# EAGLE design 36s_Cell_Fixtures_3by3 (EAGLE 5.12)
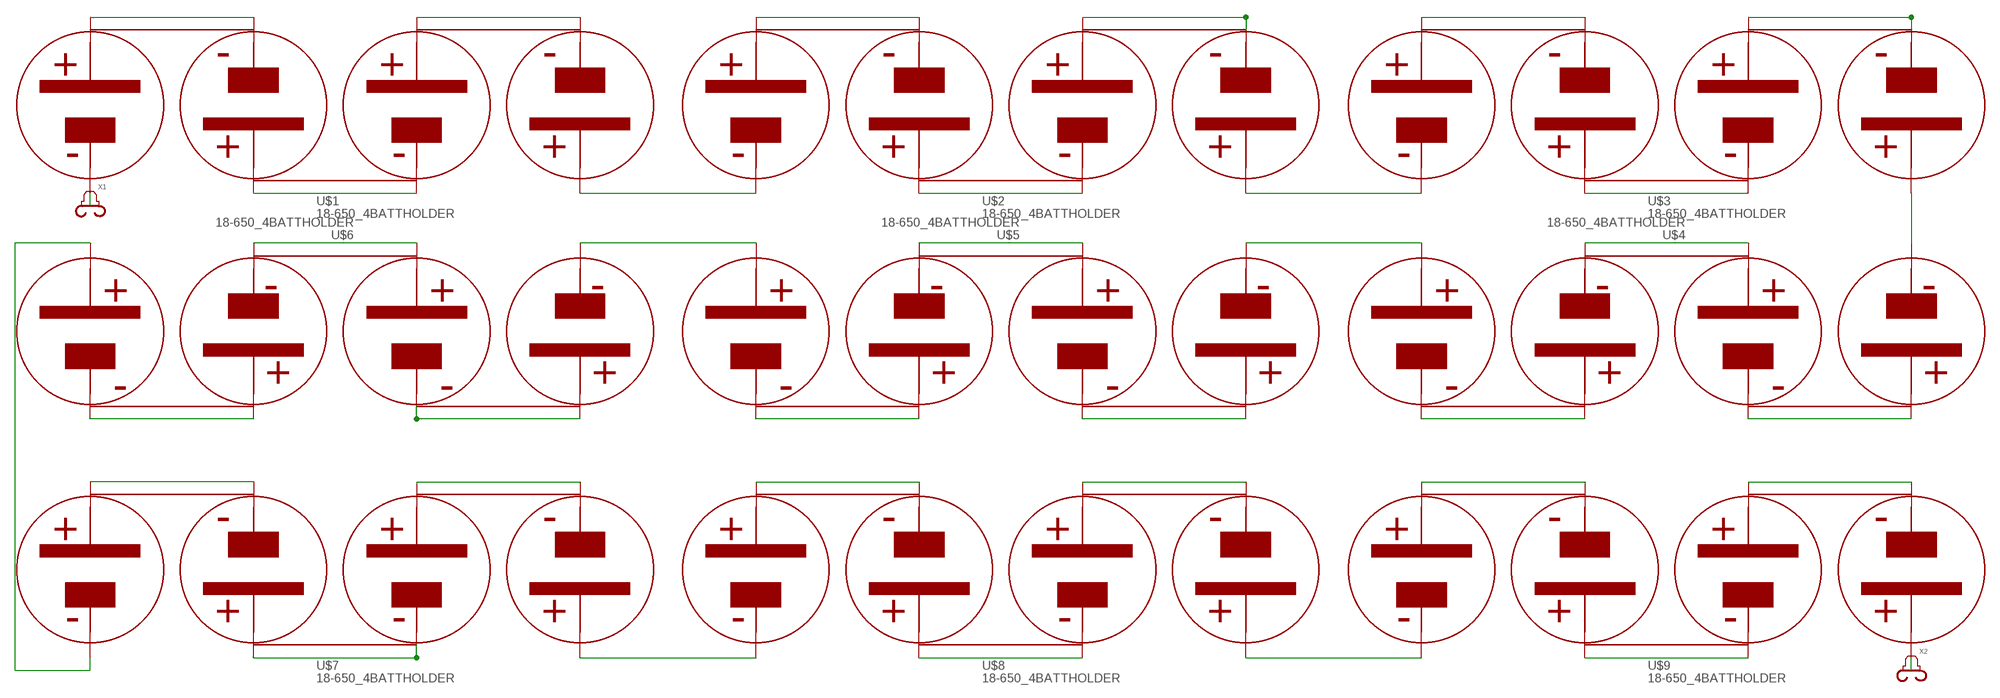
[diagram p0: schematic, sheet 1]

## Parts
U$1  18-650_4BATTHOLDER  [18650-4BATT]
U$2  18-650_4BATTHOLDER  [18650-4BATT]
U$3  18-650_4BATTHOLDER  [18650-4BATT]
U$4  18-650_4BATTHOLDER  [18650-4BATT]
U$5  18-650_4BATTHOLDER  [18650-4BATT]
U$6  18-650_4BATTHOLDER  [18650-4BATT]
U$7  18-650_4BATTHOLDER  [18650-4BATT]
U$8  18-650_4BATTHOLDER  [18650-4BATT]
U$9  18-650_4BATTHOLDER  [18650-4BATT]
X1  FASTON_FEMALE_BLADE_CONN-HORIZ-PCB  [FASTON_1217107-1]
X2  FASTON_FEMALE_BLADE_CONN-HORIZ-PCB  [FASTON_1217107-1]

## Nets
N$1: U$1.BATT+1 U$1.BATT-2
N$2: U$1.BATT+2 U$1.BATT-3
N$3: U$1.BATT+3 U$1.BATT-4
N$4: U$1.BATT+4 U$2.BATT-1
N$5: U$2.BATT+1 U$2.BATT-2
N$6: U$2.BATT+2 U$2.BATT-3
N$7: U$2.BATT+3 U$2.BATT-4
N$8: U$2.BATT+4 U$3.BATT-1
N$9: U$3.BATT+1 U$3.BATT-2
N$10: U$3.BATT+2 U$3.BATT-3
N$11: U$3.BATT+3 U$3.BATT-4
N$12: U$3.BATT+4 U$4.BATT-1
N$13: U$4.BATT+1 U$4.BATT-2
N$14: U$4.BATT+2 U$4.BATT-3
N$15: U$4.BATT+3 U$4.BATT-4
N$16: U$4.BATT+4 U$5.BATT-1
N$17: U$5.BATT+1 U$5.BATT-2
N$18: U$5.BATT+2 U$5.BATT-3
N$19: U$5.BATT+3 U$5.BATT-4
N$20: U$5.BATT+4 U$6.BATT-1
N$21: U$6.BATT+1 U$6.BATT-2
N$22: U$6.BATT+2 U$6.BATT-3
N$23: U$6.BATT+3 U$6.BATT-4
N$24: U$6.BATT+4 U$7.BATT-1
N$25: U$7.BATT+1 U$7.BATT-2
N$26: U$7.BATT+2 U$7.BATT-3
N$27: U$7.BATT+3 U$7.BATT-4
N$28: U$7.BATT+4 U$8.BATT-1
N$29: U$8.BATT+1 U$8.BATT-2
N$30: U$8.BATT+2 U$8.BATT-3
N$31: U$8.BATT+3 U$8.BATT-4
N$32: U$8.BATT+4 U$9.BATT-1
N$33: U$9.BATT+1 U$9.BATT-2
N$34: U$9.BATT+2 U$9.BATT-3
N$35: U$9.BATT+3 U$9.BATT-4
N$36: U$1.BATT-1 X1.1
N$37: U$9.BATT+4 X2.1

## Library data of the parts
U$1-U$9 = MPD:18-650_4BATTHOLDER: Datasheet: http://www.memoryprotectiondevices.com/datasheets/BK-18650-PC8-datasheet.pdf Used in 18-650 cell fixtures 12/3/14; PARTNO: BK-18650-PC8
X1 X2 = TE-Aaron:FASTON_FEMALE_BLADE_CONN: TE Faston - female PCB-mount blade terminal; PARTNO: 1217107-1

## Board
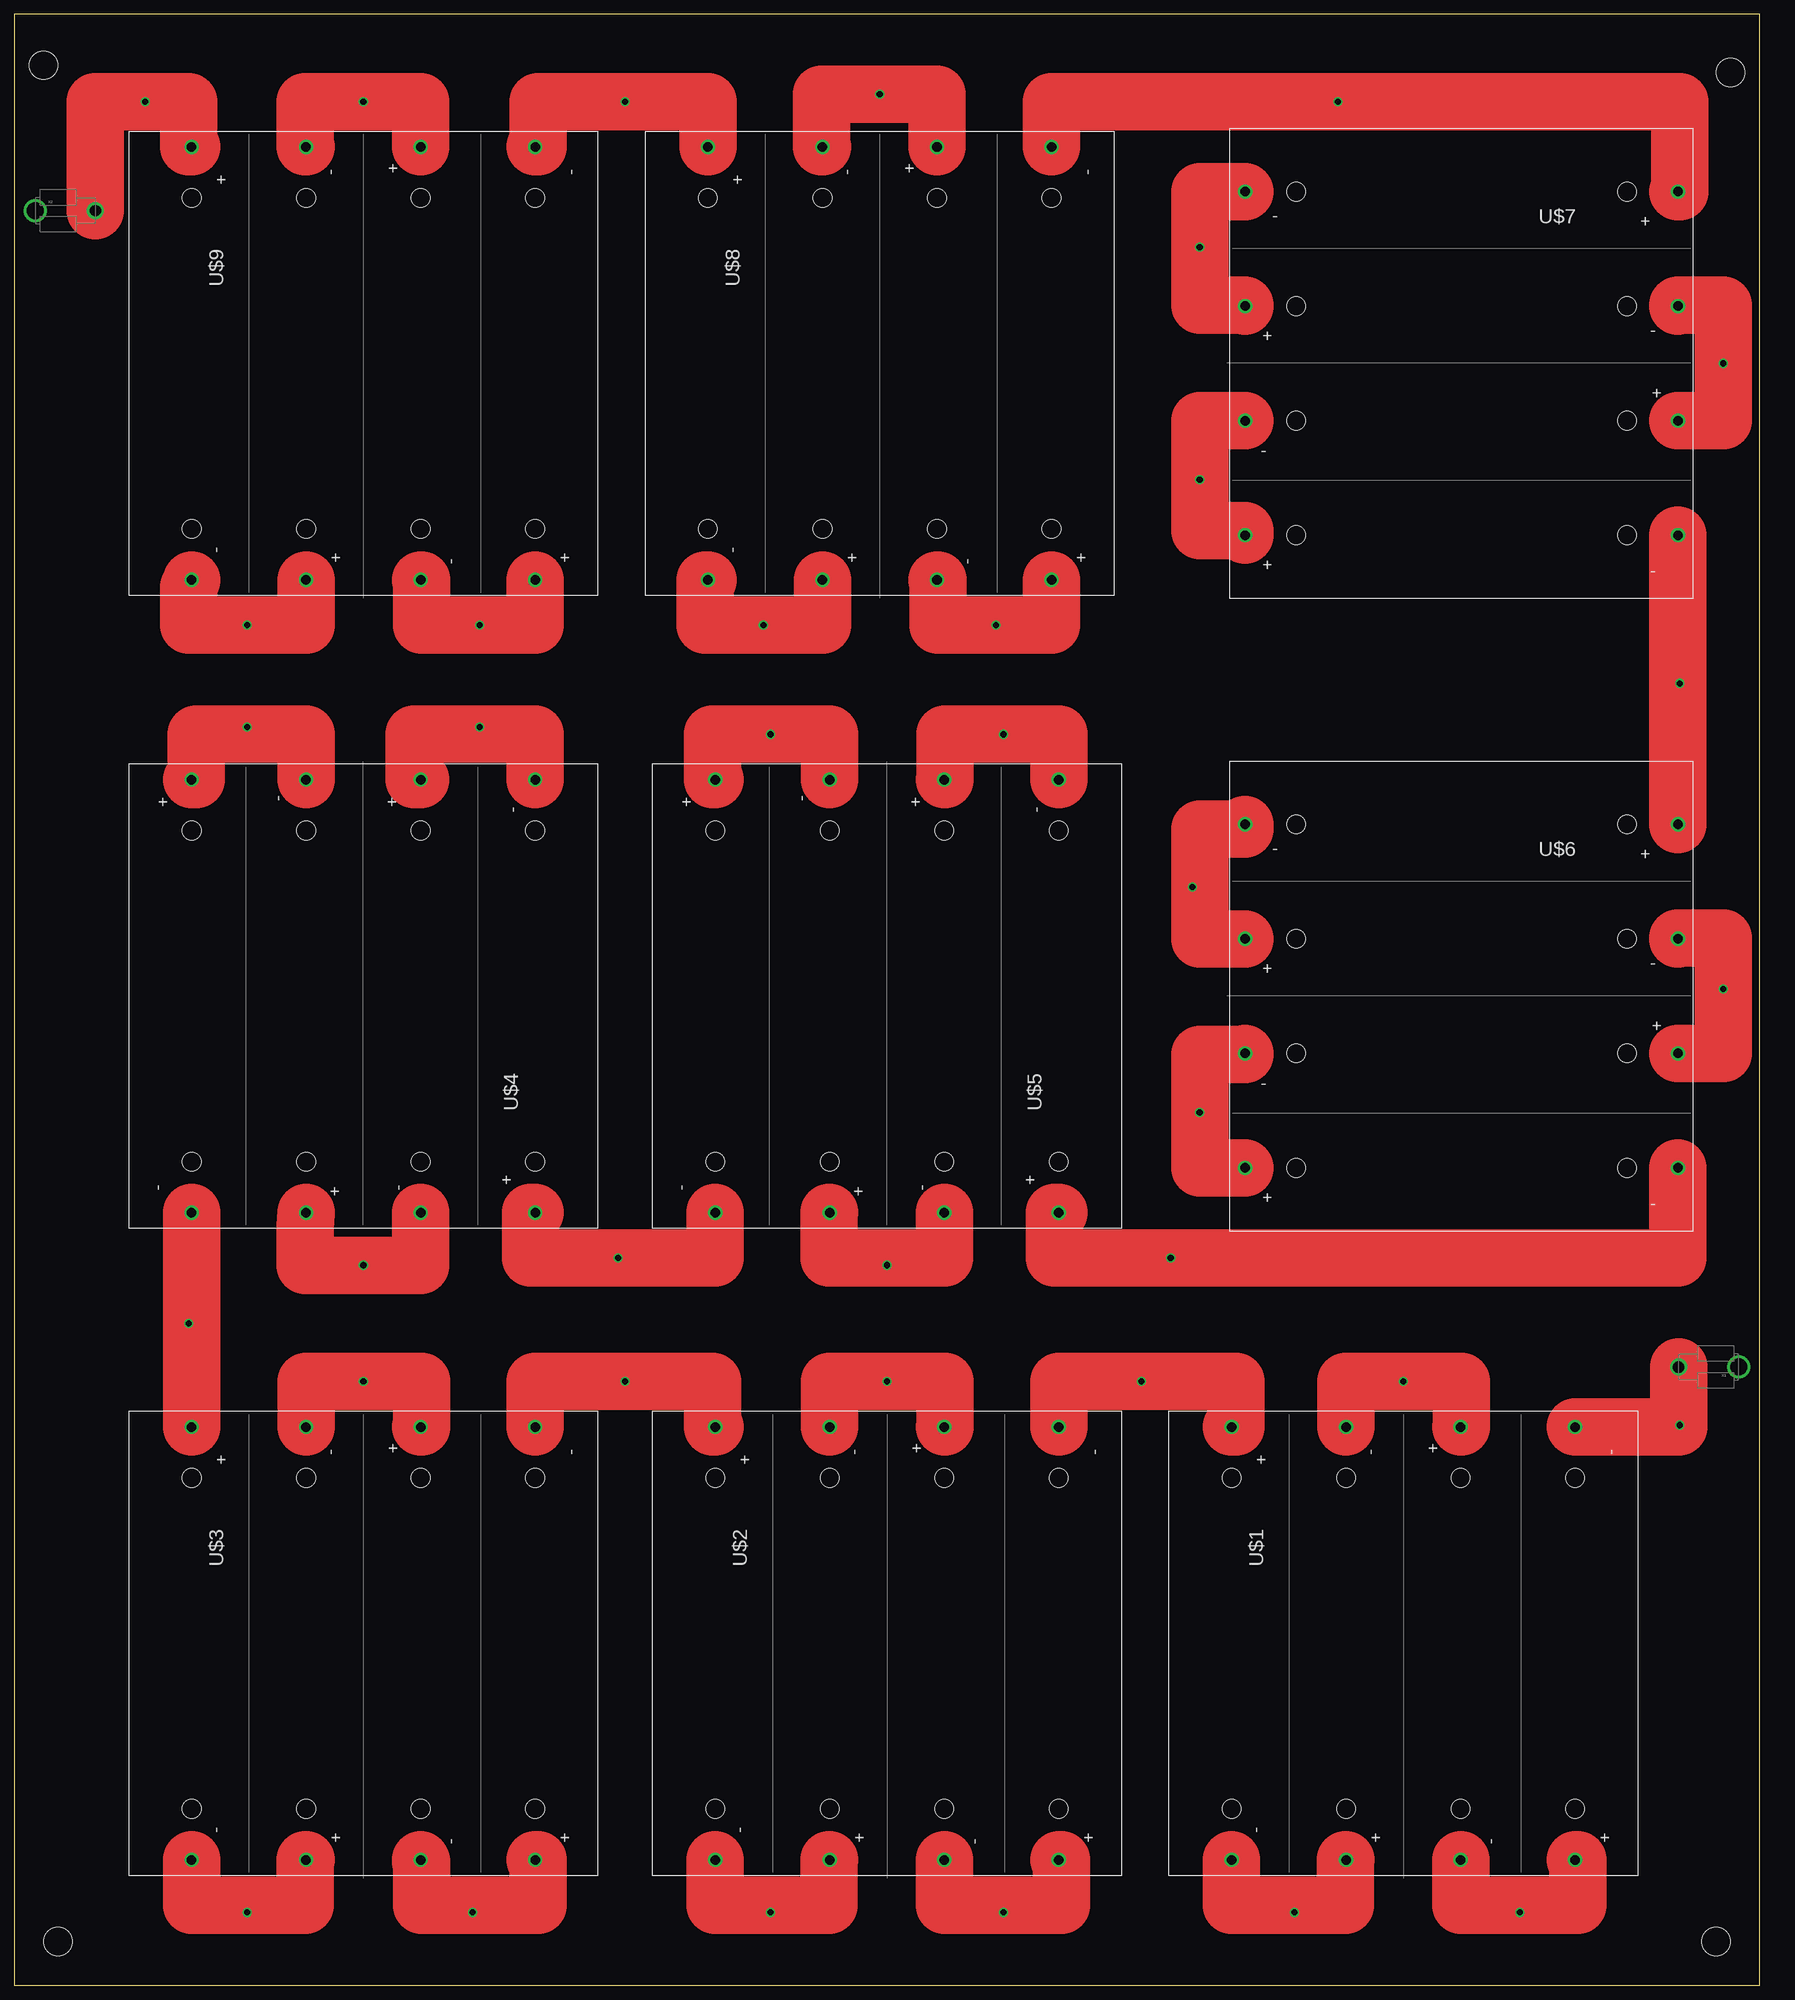
[diagram p1: board, top side]

Size 304.8 x 344.17 mm. Coordinates in mm from the lower left corner, seen from the top.
Outline: 0,0 304.8,0 304.8,344.17 0,344.17 0,0
Copper layers (1*16): Top 0.035mm / dielectric 1.5mm / Bottom 0.035mm
Design rules "default": minimum track width 10mil, minimum drill 24mil, track to track 8mil, track to pad 8mil, pad to pad 8mil, via to via 8mil, smd to smd 8mil, copper to edge 40mil, drill to drill 8mil, minimum pad ring 10mil, minimum via ring 8mil, stop-mask expansion 4mil, vias tented up to drill 0mil, thermal gap 10mil
Holes 5 mm at 7.62,7.62 297.18,7.62 299.72,334.01 5.08,335.28

### Footprints (pad centres in the part's own frame; a part is rotated, then mirrored left to right if it is on the bottom)
18650-4BATT = drill 1.66 round: BATT+1 37.8,30; BATT+2 -37.8,10; BATT+3 37.8,-10; BATT+4 -37.8,-30; BATT-1 -37.8,30; BATT-2 37.8,10; BATT-3 -37.8,-10; BATT-4 37.8,-30 | hole 3.3: -28.9,30; -28.9,10; -28.9,-10; -28.9,-30; 28.9,-30; 28.9,-10; 28.9,10; 28.9,30
FASTON_1217107-1 = drill 2 round: 1 5.25,0 | drill 3 round: 3 -5.25,0

### Placement (x,y rotation side)
U$1  242.57,59.69 270 top
U$2  152.4,59.69 270 top
U$3  60.96,59.69 270 top
U$4  60.96,172.72 90 top
U$5  152.4,172.72 90 top
U$6  252.73,172.72 180 top
U$7  252.73,283.21 180 top
U$8  151.13,283.21 270 top
U$9  60.96,283.21 270 top
X1  295.91,107.95 180 top
X2  8.89,309.88 0 top

### Tracks (layer width: path | path; a pad name or v marks a point on that pad's centre or on a via)
N$1
  Top 10: U$1.BATT+1 273.05,21.89 273.05,13.97 252.57,13.97 U$1.BATT-2
N$2  (via drill 1.07)
  Top 10: U$1.BATT+2 252.73,97.49 252.73,105.41 v242.57,105.41 232.57,105.41 U$1.BATT-3
N$3
  Top 10: U$1.BATT+3 232.41,21.89 232.41,13.97 212.57,13.97 U$1.BATT-4
N$4  (via drill 1.07)
  Top 10: U$1.BATT+4 213.36,97.49 213.36,105.41 v196.85,105.41 182.4,105.41 U$2.BATT-1
N$5
  Top 10: U$2.BATT+1 182.88,21.89 182.88,13.97 162.4,13.97 U$2.BATT-2
N$6  (via drill 1.07)
  Top 10: U$2.BATT+2 162.56,97.49 162.56,105.41 v152.4,105.41 142.4,105.41 U$2.BATT-3
N$7
  Top 10: U$2.BATT+3 142.24,21.89 142.24,13.97 122.4,13.97 U$2.BATT-4
N$8  (via drill 1.07)
  Top 10: U$2.BATT+4 121.92,97.49 121.92,105.41 v106.68,105.41 90.96,105.41 U$3.BATT-1
N$9
  Top 10: U$3.BATT+1 91.44,21.89 91.44,13.97 71.12,13.97 71.12,21.59 70.96,21.59 U$3.BATT-2
N$10  (via drill 1.07)
  Top 10: U$3.BATT+2 71.12,97.49 71.12,105.41 v60.96,105.41 50.96,105.41 U$3.BATT-3
N$11
  Top 10: U$3.BATT+3 50.8,21.89 50.8,13.97 30.96,13.97 U$3.BATT-4
N$12
  Top 10: U$3.BATT+4 U$4.BATT-1
N$13
  Top 10: U$4.BATT+1 31.75,210.52 31.75,218.44 50.96,218.44 U$4.BATT-2
N$14  (via drill 1.07)
  Top 10: U$4.BATT+2 50.8,132.38 50.8,125.73 v60.96,125.73 70.96,125.73 U$4.BATT-3
N$15
  Top 10: U$4.BATT+3 69.85,210.52 69.85,218.44 90.96,218.44 U$4.BATT-4
N$16  (via drill 1.07)
  Top 10: U$4.BATT+4 90.17,134.92 90.17,127 v105.41,127 122.4,127 U$5.BATT-1
N$17  (via drill 1.07)
  Top 10: U$5.BATT+1 121.92,210.52 121.92,218.44 v132.08,218.44 142.4,218.44 U$5.BATT-2
N$18
  Top 10: U$5.BATT+2 142.24,134.92 142.24,127 162.4,127 U$5.BATT-3
N$19  (via drill 1.07)
  Top 10: U$5.BATT+3 162.56,210.52 162.56,218.44 v172.72,218.44 182.4,218.44 U$5.BATT-4
N$20  (via drill 1.07)
  Top 10: U$5.BATT+4 181.61,134.92 181.61,127 v201.93,127 290.53,127 U$6.BATT-1
N$21  (via drill 1.07)
  Top 10: U$6.BATT+1 207.01,142.72 v207.01,152.4 207.01,162.56 214.93,162.56 U$6.BATT-2
N$22  (via drill 1.07)
  Top 10: U$6.BATT+2 298.45,162.72 v298.45,173.99 298.45,182.88 290.53,182.88 U$6.BATT-3
N$23
  Top 10: U$6.BATT+3 207.01,182.72 207.01,201.93 214.93,201.93 U$6.BATT-4
N$24
  Top 10: U$6.BATT+4 U$7.BATT-1
N$25  (via drill 1.07)
  Top 10: U$7.BATT-2 207.01,273.21 v207.01,262.89 207.01,254 214.93,254 U$7.BATT+1
N$26  (via drill 1.07)
  Top 10: U$7.BATT+2 298.45,273.21 v298.45,283.21 298.45,293.37 290.53,293.37 U$7.BATT-3
N$27  (via drill 1.07)
  Top 10: U$7.BATT-4 207.01,313.21 v207.01,303.53 207.01,293.37 214.93,293.37 U$7.BATT+3
N$28  (via drill 1.07)
  Top 10: U$7.BATT+4 290.83,313.21 290.83,328.93 v231.14,328.93 181.13,328.93 U$8.BATT-1
N$29  (via drill 1.07)
  Top 10: U$8.BATT-2 161.29,245.41 161.29,237.49 v171.45,237.49 181.13,237.49 U$8.BATT+1
N$30  (via drill 1.07)
  Top 10: U$8.BATT-3 140.97,321.01 140.97,330.2 v151.13,330.2 161.13,330.2 U$8.BATT+2
N$31  (via drill 1.07)
  Top 10: U$8.BATT-4 120.65,245.41 120.65,237.49 v130.81,237.49 141.13,237.49 U$8.BATT+3
N$32  (via drill 1.07)
  Top 10: U$9.BATT-1 91.44,321.01 91.44,328.93 v106.68,328.93 121.13,328.93 U$8.BATT+4
N$33  (via drill 1.07)
  Top 10: U$9.BATT-2 71.12,245.41 71.12,237.49 v81.28,237.49 90.96,237.49 U$9.BATT+1
N$34  (via drill 1.07)
  Top 10: U$9.BATT-3 50.8,321.01 50.8,328.93 v60.96,328.93 70.96,328.93 U$9.BATT+2
N$35  (via drill 1.07)
  Top 10: U$9.BATT-4 30.48,244.14 30.48,237.49 v40.64,237.49 50.96,237.49 U$9.BATT+3
N$36
  Top 10: U$1.BATT-1 290.66,97.49 X1.1
N$37  (via drill 1.07)
  Top 10: U$9.BATT+4 30.48,321.01 30.48,328.93 v22.86,328.93 14.14,328.93 X2.1
N$38  (via drill 1.07)
  other vias: 262.89,12.7
N$39  (via drill 1.07)
  other vias: 223.52,12.7
N$40  (via drill 1.07)
  other vias: 172.72,12.7
N$41  (via drill 1.07)
  other vias: 132.08,12.7
N$42  (via drill 1.07)
  other vias: 80.01,12.7
N$43  (via drill 1.07)
  other vias: 40.64,12.7
N$44  (via drill 1.07)
  other vias: 152.4,125.73
N$45  (via drill 1.07)
  other vias: 30.48,115.57
N$46  (via drill 1.07)
  other vias: 290.83,97.79
N$47  (via drill 1.07)
  other vias: 205.74,191.77
N$48  (via drill 1.07)
  other vias: 40.64,219.71
N$49  (via drill 1.07)
  other vias: 81.28,219.71
N$50  (via drill 1.07)
  other vias: 290.83,227.33